# Altium schematic sheet SchLed.SchDoc
size A
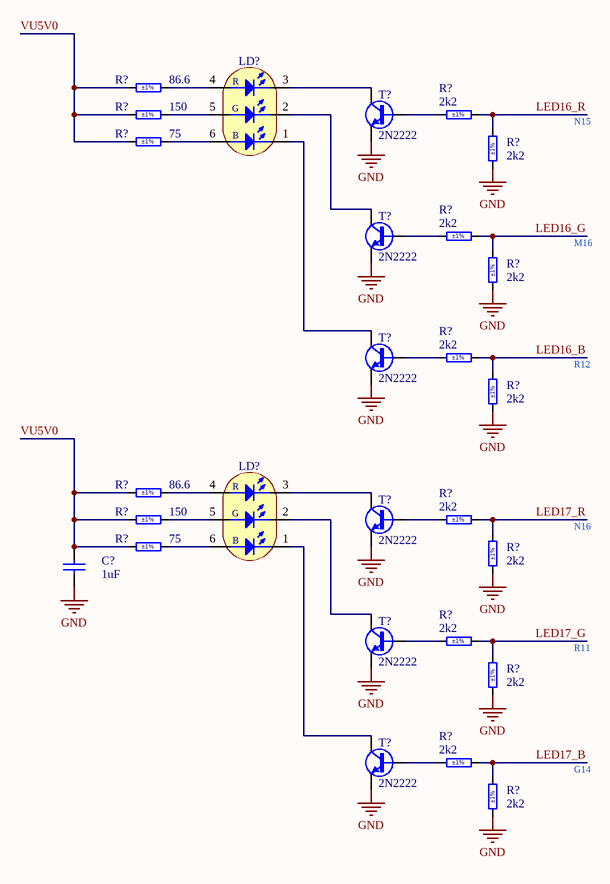
[diagram p0: SchLed.SchDoc]

## Parts
(Parts that share a designator on the sheet are numbered #1, #2 ... from top to bottom, then left to right.)
C?  1uF  [CAPC1005X55N]
LD?#1  Red/Green/Blue  [LED_AVAGO_ASMT-YTB7-0AA02]  (value not drawn)
LD?#2  Red/Green/Blue  [LED_AVAGO_ASMT-YTB7-0AA02]  (value not drawn)
R?#1  86.6  Tolerance: ±1%  [RESC1005X40N]
R?#2  150  Tolerance: ±1%  [RESC1005X40N]
R?#3  2k2  Tolerance: ±1%  [RESC1005X40N]
R?#4  75  Tolerance: ±1%  [RESC1005X40N]
R?#5  2k2  Tolerance: ±1%  [RESC1005X40N]
R?#6  2k2  Tolerance: ±1%  [RESC1005X40N]
R?#7  2k2  Tolerance: ±1%  [RESC1005X40N]
R?#8  2k2  Tolerance: ±1%  [RESC1005X40N]
R?#9  2k2  Tolerance: ±1%  [RESC1005X40N]
R?#10  86.6  Tolerance: ±1%  [RESC1005X40N]
R?#11  150  Tolerance: ±1%  [RESC1005X40N]
R?#12  2k2  Tolerance: ±1%  [RESC1005X40N]
R?#13  75  Tolerance: ±1%  [RESC1005X40N]
R?#14  2k2  Tolerance: ±1%  [RESC1005X40N]
R?#15  2k2  Tolerance: ±1%  [RESC1005X40N]
R?#16  2k2  Tolerance: ±1%  [RESC1005X40N]
R?#17  2k2  Tolerance: ±1%  [RESC1005X40N]
R?#18  2k2  Tolerance: ±1%  [RESC1005X40N]
T?#1  2N2222  [TO-18]
T?#2  2N2222  [TO-18]
T?#3  2N2222  [TO-18]
T?#4  2N2222  [TO-18]
T?#5  2N2222  [TO-18]
T?#6  2N2222  [TO-18]

## Nets
GND: C?.1 R?#5.1 R?#7.1 R?#9.1 R?#14.1 R?#16.1 R?#18.1 T?#1.1(E) T?#2.1(E) T?#3.1(E) T?#4.1(E) T?#5.1(E) T?#6.1(E)
LED16_B: R?#8.2 R?#9.2
LED16_G: R?#6.2 R?#7.2
LED16_R: R?#3.2 R?#5.2
LED17_B: R?#17.2 R?#18.2
LED17_G: R?#15.2 R?#16.2
LED17_R: R?#12.2 R?#14.2
VU5V0: C?.2 R?#1.1 R?#2.1 R?#4.1 R?#10.1 R?#11.1 R?#13.1
NetLD?#1_1: LD?#1.1(CB) T?#3.3(C)
NetLD?#1_2: LD?#1.2(CG) T?#2.3(C)
NetLD?#1_3: LD?#1.3(CR) T?#1.3(C)
NetLD?#1_4: LD?#1.4(AR) R?#1.2
NetLD?#1_5: LD?#1.5(AG) R?#2.2
NetLD?#1_6: LD?#1.6(AB) R?#4.2
NetLD?#2_1: LD?#2.1(CB) T?#6.3(C)
NetLD?#2_2: LD?#2.2(CG) T?#5.3(C)
NetLD?#2_3: LD?#2.3(CR) T?#4.3(C)
NetLD?#2_4: LD?#2.4(AR) R?#10.2
NetLD?#2_5: LD?#2.5(AG) R?#11.2
NetLD?#2_6: LD?#2.6(AB) R?#13.2
NetR?#3_1: R?#3.1 T?#1.2(B)
NetR?#6_1: R?#6.1 T?#2.2(B)
NetR?#8_1: R?#8.1 T?#3.2(B)
NetR?#12_1: R?#12.1 T?#4.2(B)
NetR?#15_1: R?#15.1 T?#5.2(B)
NetR?#17_1: R?#17.1 T?#6.2(B)

## Notes on the sheet
- N15
- M16
- R12
- N16
- R11
- G14
- (in symbol LED_AVAGO_ASMT-YTB7-0AA02) R; G; B

## Library data of the parts
C? = CC0402_30PF_50V_1%_C0G_MURATA_GJM1555C1H300FB01: Non-polarised capacitor; Part Description: High-Q SMD Chip Monolithic Ceramic Capacitor; Manufacturer: MURATA; Value: 30pF; Voltage: 50V; TC: C0G/NP0; Tolerance: ±1%; Part Number: CC0402_30PF_50V_1%_C0G_MURATA_GJM1555C1H300FB01; Component Kind: Standard; Component Type: Standard; Pin Count: 2; Status: None; Manufacturer Part Number: GJM1555C1H300FB01; Case: 0402; Mounted: Yes; Socket: No; SMD: Yes; Sense: No; ComponentHeight: 0.55mm; HelpURL: \\cern.ch\dfs\Applications\Altium\Datasheets\CC0402_MURATA_GJM1555C1H300FB01D.pdf; Author: CERN DEM BC; CreateDate: 20. 11. 2017; LatestRevisionDate: 20. 11. 2017
LD?#1 LD?#2 = LED_AVAGO_ASMT-YTB7-0AA02: High Brightness Tricolor (RGB) Surface Mount LED With Black Surface; Manufacturer: AVAGO TECHNOLOGIES; PressFit: No; Bonding: No; Part Number: LED_AVAGO_ASMT-YTB7-0AA02; Component Kind: Standard; Component Type: Standard; Color: Red/Green/Blue; PackageDescription: High Brightness Tricolor (RGB) Surface Mount LED With Black Top Surface, Body 3x2.8mm; Part Description: High Brightness Tricolor (RGB) Surface Mount LED With Black Surface; Manufacturer Part Number: ASMT-YTB7-0AA02; Pin Count: 6; Case: PLCC-6; Mounted: Yes; Socket: No; SMD: Yes; Sense: No; ComponentHeight: 1.8mm; HelpURL: \\cern.ch\dfs\Applications\Altium\Datasheets\LED_AVAGO_ASMT-YTB7-0AA02.pdf; Author: CERN DEM JMW; CreateDate: 9. 7. 2015; LatestRevisionDate: 9. 7. 2015
R?#1-R?#18 = R0402_10K_1%_0.0625W_100PPM: Resistor - 1%; Part Description: General Purpose Thick Film Chip Resistor; Manufacturer: GENERIC; Manufacturer1 Part Number: 232270671003L; Value: 10k; TC: ±100ppm/°C; PressFit: No; Part Number: R0402_10K_1%_0.0625W_100PPM; Component Kind: Standard; Component Type: Standard; Pin Count: 2; Status: Not Recommended; Power: 0.0625W; Manufacturer Part Number: R0402_10K_1%_0.0625W_100PPM; Case: 0402; Mounted: Yes; Sense: No; Socket: No; SMD: Yes; Manufacturer1 Example: YAGEO PHYCOMP; Manufacturer1 ComponentHeight: 0.4mm; HelpURL: \\cern.ch\dfs\Applications\Altium\Datasheets\R0402_Phycomp_RC0402.pdf; Author: CERN DEM JLC; CreateDate: 3. 12. 2007; LatestRevisionDate: 17. 10. 2012
T?#1-T?#6 = 2N2222: NPN Transistor; Part Description: 30V, 800mA, NPN Silicon Transistor; Manufacturer: SEMELAB; PressFit: No; Bonding: No; Part Number: 2N2222; Component Kind: Standard; Component Type: Standard; Device: 2N2222; PackageDescription: TO-18  3 Leads, Pitch 2.54mm, Body Dia. 5.84mm, Leads Dia. 0.5mm; Manufacturer Part Number: 2N2222; Pin Count: 3; Case: TO-18; Mounted: Yes; Socket: No; SMD: No; Sense: No; ComponentHeight: 10.13mm; HelpURL: \\cern.ch\dfs\Applications\Altium\Datasheets\2N2222.pdf; Author: CERN DEM JLC; CreateDate: 20. 11. 2008; LatestRevisionDate: 31. 5. 2017